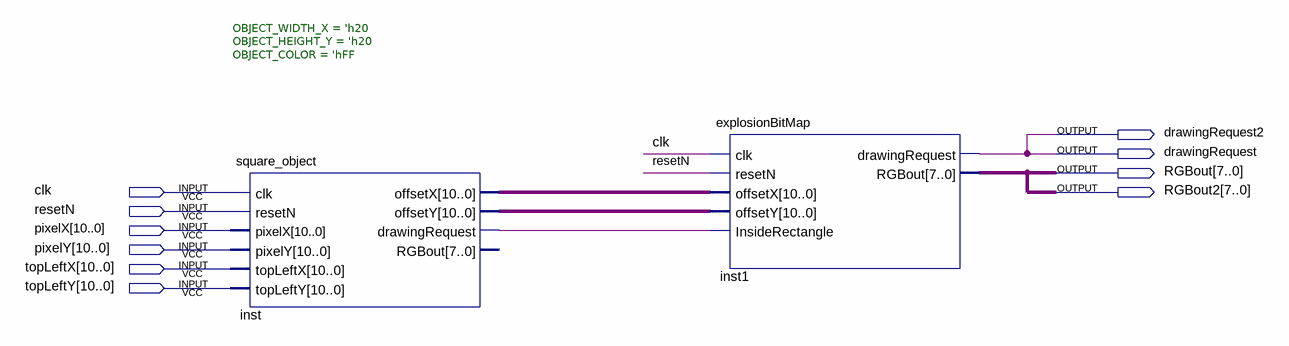
[diagram p0: schematic sheet]
// Quartus schematic explosion_block.bdf as structural Verilog: 2 symbols, 10 pins
module explosion_block (
  input  clk,
  input  resetN,
  input  [10:0] pixelX,
  input  [10:0] pixelY,
  input  [10:0] topLeftX,
  input  [10:0] topLeftY,
  output drawingRequest2,
  output drawingRequest,
  output [7:0] RGBout,
  output [7:0] RGBout2
);

  wire inst_drawingrequest;
  wire [10:0] inst_offsetx, inst_offsety;

  square_object #(.OBJECT_WIDTH_X('h20), .OBJECT_HEIGHT_Y('h20), .OBJECT_COLOR('hFF)) inst (
    .clk(clk), .resetN(resetN), .pixelX(pixelX), .pixelY(pixelY), .topLeftX(topLeftX), .topLeftY(topLeftY),
    .offsetX(inst_offsetx), .offsetY(inst_offsety), .drawingRequest(inst_drawingrequest));  // open: RGBout
  explosionBitMap inst1 (
    .clk(clk), .resetN(resetN), .offsetX(inst_offsetx), .offsetY(inst_offsety),
    .InsideRectangle(inst_drawingrequest), .drawingRequest(drawingRequest), .RGBout(RGBout));

  assign drawingRequest2 = drawingRequest;
  assign RGBout2 = RGBout;
endmodule
